# EAGLE design Transmitter (EAGLE 7.4.0)
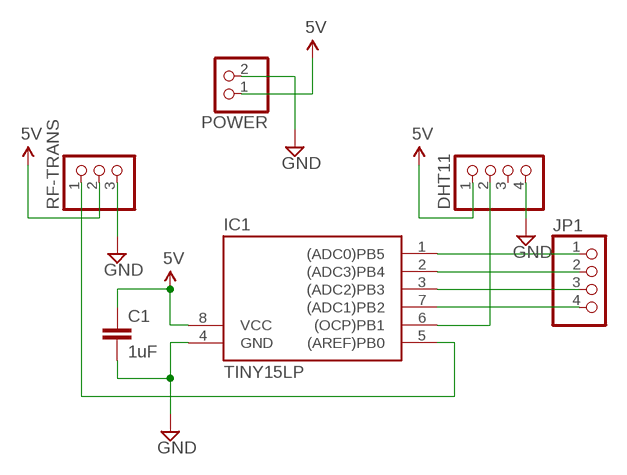
[diagram p0: schematic, sheet 1]

## Parts
C1  1uF  CAP0805  [0805]
DHT11  PINHD-1X4  [1X04]
IC1  TINY15LP  [DIL08]
JP1  PINHD-1X4  [1X04]
POWER  PINHD-1X2  [1X02]
RF-TRANS  PINHD-1X3  [1X03]

## Nets
5V: C1.1 DHT11.1 IC1.8(VCC) POWER.1 RF-TRANS.2
GND: C1.2 DHT11.4 IC1.4(GND) POWER.2 RF-TRANS.3
N$1: IC1.5((AREF)PB0) RF-TRANS.1
N$2: DHT11.2 IC1.6((OCP)PB1)
N$3: IC1.1((ADC0)PB5) JP1.1
N$4: IC1.2((ADC3)PB4) JP1.2
N$5: IC1.3((ADC2)PB3) JP1.3
N$6: IC1.7((ADC1)PB2) JP1.4
Unconnected: DHT11.3

## Library data of the parts
C1 = SparkFun-Capacitors:CAP: Capacitor Standard 0603 ceramic capacitor, and 0.1" leaded capacitor.
DHT11 JP1 = pinhead:PINHD-1X4: PIN HEADER
IC1 = atmel:TINY15L: MICROCONTROLLER 2.7 V 1 Kbytes FLASH 64 bytes EEPROM 4-channel 10 bit ADC; OC_FARNELL: unknown; OC_NEWARK: unknown
POWER = pinhead:PINHD-1X2: PIN HEADER
RF-TRANS = pinhead:PINHD-1X3: PIN HEADER

## Board
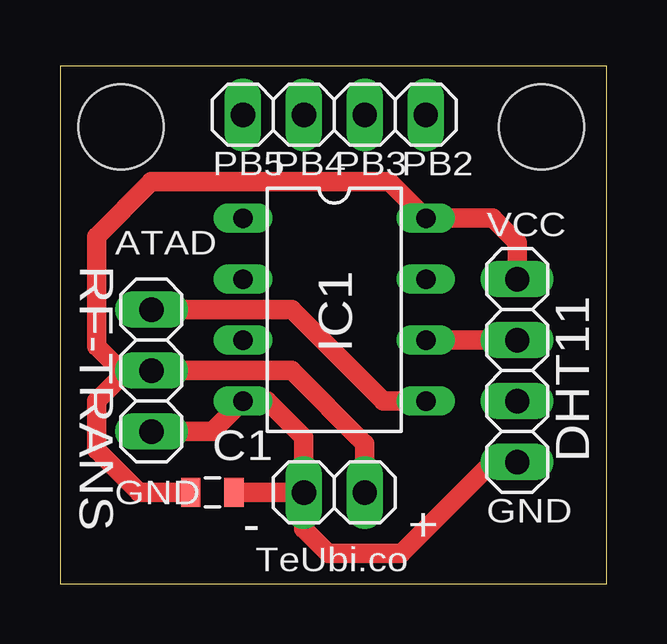
[diagram p1: board, top side]
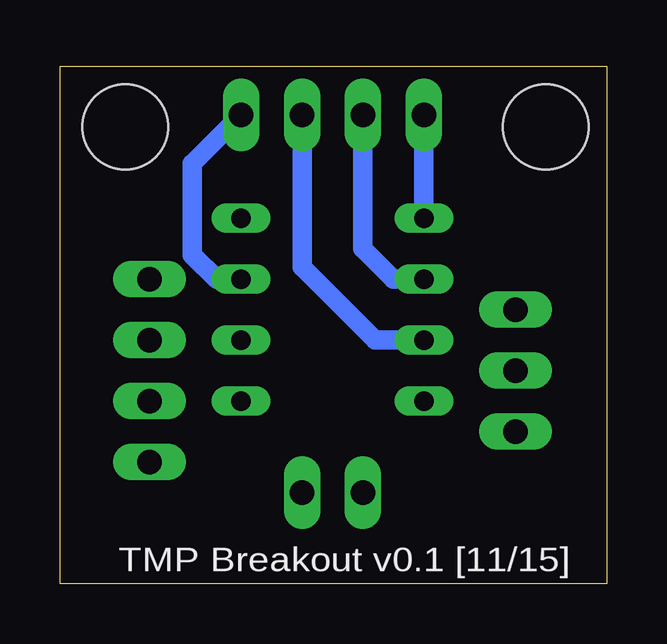
[diagram p2: board, bottom side, seen from below]

Size 22.78 x 21.58 mm. Coordinates in mm from the lower left corner, seen from the top.
Outline: 0,0 22.78,0 22.78,21.58 0,21.58 0,0
Copper layers (1*16): Top 0.0356mm / dielectric 1.5011mm / Bottom 0.0356mm
Design rules "LaenPCBOrder": minimum track width 6mil, minimum drill 13mil, track to track 6mil, track to pad 6mil, pad to pad 6mil, via to via 6mil, smd to smd 6mil, copper to edge 15mil, drill to drill 6mil, minimum pad ring 7mil, minimum via ring 7mil, stop-mask expansion 3mil, vias tented up to drill 0mil, thermal gap 10mil
Holes 3.56 mm at 2.54,19.05 20.07,19.05

### Footprints (pad centres in the part's own frame; a part is rotated, then mirrored left to right if it is on the bottom)
0805 = smd 0.8 x 1.2: 1 -0.9,0; 2 0.9,0
1X04 = drill 1.016 long: 1 -3.81,0; 2 -1.27,0; 3 1.27,0; 4 3.81,0
DIL08 = drill 0.813 long: 1 -3.81,-3.81; 2 -1.27,-3.81; 3 1.27,-3.81; 4 3.81,-3.81; 5 3.81,3.81; 6 1.27,3.81; 7 -1.27,3.81; 8 -3.81,3.81
1X02 = drill 1.016 long: 1 -1.27,0; 2 1.27,0
1X03 = drill 1.016 long: 1 -2.54,0; 2 0,0; 3 2.54,0

### Placement (x,y rotation side)
C1  6.35,3.81 0 top
DHT11  19.05,8.89 270 top
IC1  11.43,11.43 270 top
JP1  11.43,19.56 0 top
POWER  11.43,3.81 180 top
RF-TRANS  3.81,8.89 270 top

### Tracks (layer width: path | path; a pad name or v marks a point on that pad's centre or on a via)
5V
  Top 0.813: RF-TRANS.2 2.54,8.89 1.52,9.91 1.52,14.48 3.81,16.76 13.72,16.76 IC1.8 18.03,15.24 19.05,14.22 DHT11.1 | POWER.1 12.7,5.84 9.65,8.89 RF-TRANS.2 | RF-TRANS.2 2.79,8.89 1.52,7.62 1.52,5.59 3.3,3.81 C1.1
GND
  Top 0.813: RF-TRANS.3 6.35,6.35 IC1.4 8.64,7.62 10.16,6.1 POWER.2 | C1.2 POWER.2 | DHT11.4 18.03,5.08 14.22,1.27 11.18,1.27 10.16,2.29 POWER.2
N$1
  Top 0.813: IC1.5 13.46,7.62 9.65,11.43 RF-TRANS.1
N$2
  Top 0.813: IC1.6 DHT11.2
N$3
  Bottom 0.813: IC1.1 JP1.1
N$4
  Bottom 0.813: IC1.2 8.89,12.7 10.16,13.97 JP1.2
N$5
  Bottom 0.813: IC1.3 9.65,10.16 12.7,13.21 JP1.3
N$6
  Bottom 0.813: IC1.7 16.26,12.7 17.27,13.72 17.27,17.53 JP1.4

### Text on the board
tPlace: PB5 | PB4 | PB3 | PB2 | ATAD | VCC | GND | GND | - | + | TeUbi.co
bPlace: TMP Breakout v0.1 [11/15]